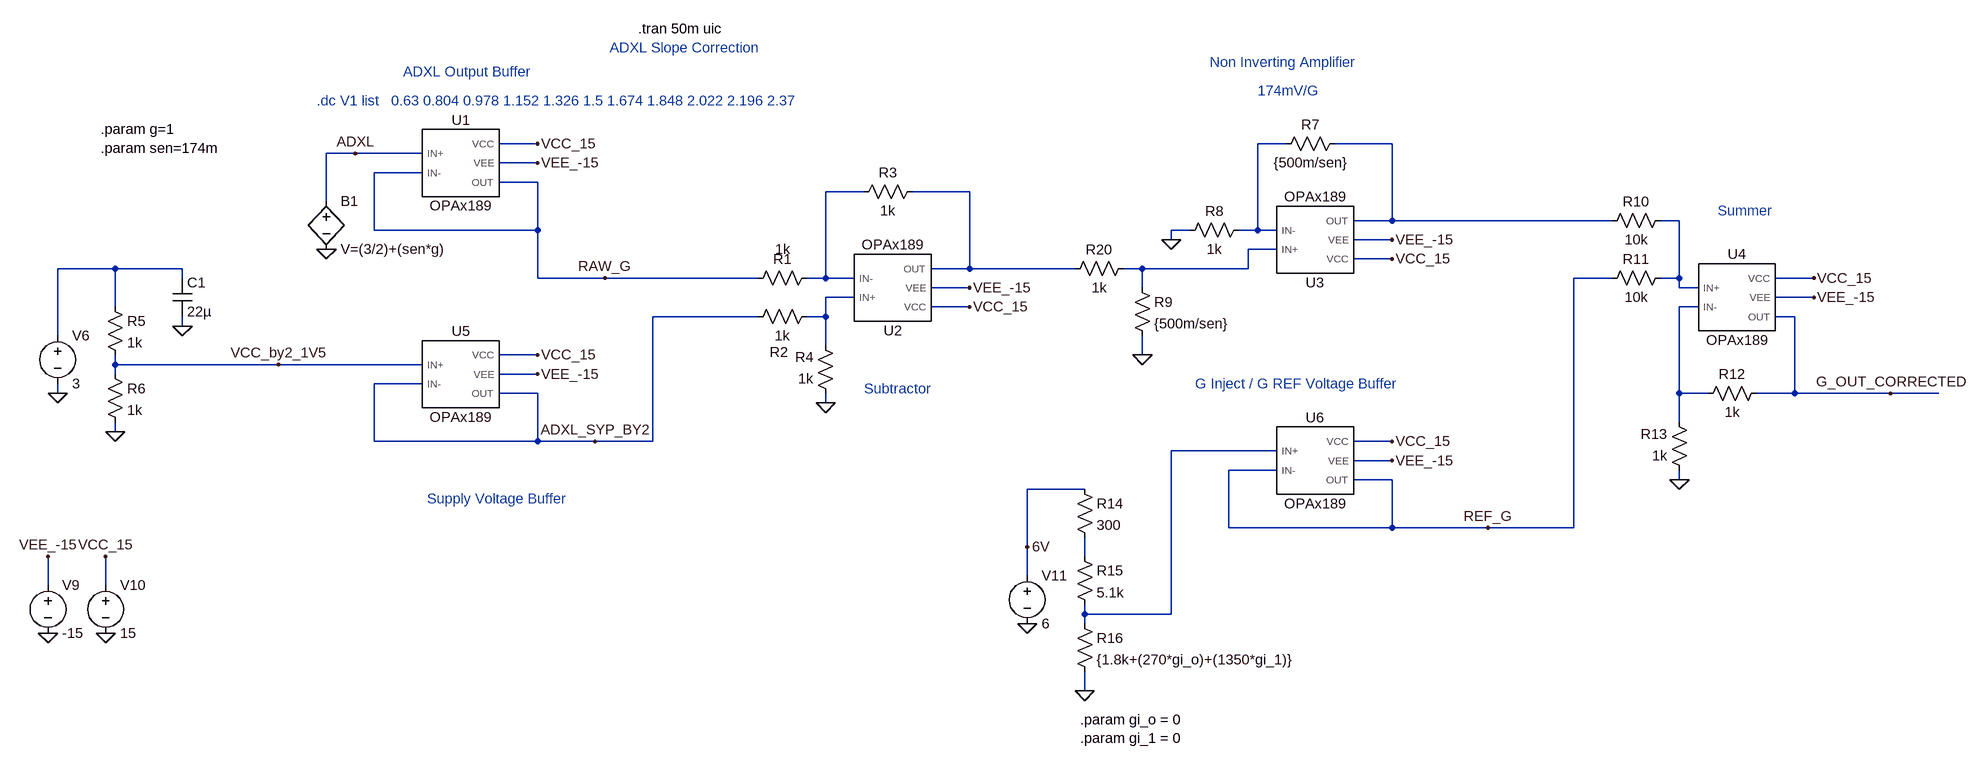
[diagram p0: schematic Sensor slope correction 10062026.asc]
Sensor slope correction 10062026.asc, the LTspice schematic file:
Version 4.1
SHEET 1 7492 1060
WIRE 352 -336 288 -336
WIRE 1600 -336 1552 -336
WIRE 1776 -336 1680 -336
WIRE 48 -320 0 -320
WIRE 160 -320 48 -320
WIRE 352 -304 288 -304
WIRE 160 -288 80 -288
WIRE 352 -272 288 -272
WIRE 896 -256 832 -256
WIRE 1072 -256 976 -256
WIRE 0 -240 0 -320
WIRE 1776 -208 1776 -336
WIRE 1776 -208 1712 -208
WIRE 2208 -208 1776 -208
WIRE 2320 -208 2288 -208
WIRE 80 -192 80 -288
WIRE 352 -192 352 -272
WIRE 352 -192 80 -192
WIRE 1440 -192 1408 -192
WIRE 1552 -192 1552 -336
WIRE 1552 -192 1520 -192
WIRE 1584 -192 1552 -192
WIRE 1408 -176 1408 -192
WIRE 1776 -176 1712 -176
WIRE 1584 -160 1536 -160
WIRE 1776 -144 1712 -144
WIRE -352 -128 -448 -128
WIRE -240 -128 -352 -128
WIRE 1072 -128 1072 -256
WIRE 1072 -128 1008 -128
WIRE 1248 -128 1072 -128
WIRE 1360 -128 1328 -128
WIRE 1536 -128 1536 -160
WIRE 1536 -128 1360 -128
WIRE -240 -112 -240 -128
WIRE 352 -112 352 -192
WIRE 464 -112 352 -112
WIRE 720 -112 464 -112
WIRE 832 -112 832 -256
WIRE 832 -112 800 -112
WIRE 880 -112 832 -112
WIRE 2208 -112 2144 -112
WIRE 2320 -112 2320 -208
WIRE 2320 -112 2288 -112
WIRE 2544 -112 2480 -112
WIRE 1072 -96 1008 -96
WIRE 1360 -96 1360 -128
WIRE 2320 -96 2320 -112
WIRE 2352 -96 2320 -96
WIRE 880 -80 832 -80
WIRE 2544 -80 2480 -80
WIRE -352 -64 -352 -128
WIRE 1072 -64 1008 -64
WIRE 2352 -64 2320 -64
WIRE 720 -48 544 -48
WIRE 832 -48 832 -80
WIRE 832 -48 800 -48
WIRE 2512 -48 2480 -48
WIRE -240 -32 -240 -48
WIRE -448 -16 -448 -128
WIRE 832 0 832 -48
WIRE 352 16 288 16
WIRE 1360 16 1360 -16
WIRE -352 32 -352 16
WIRE -80 32 -352 32
WIRE 160 32 -80 32
WIRE -352 48 -352 32
WIRE 352 48 288 48
WIRE 160 64 80 64
WIRE -448 80 -448 64
WIRE 352 80 288 80
WIRE 2320 80 2320 -64
WIRE 2368 80 2320 80
WIRE 2512 80 2512 -48
WIRE 2512 80 2448 80
WIRE 2672 80 2512 80
WIRE 2752 80 2672 80
WIRE 832 96 832 80
WIRE 2320 128 2320 80
WIRE -352 144 -352 128
WIRE 80 160 80 64
WIRE 352 160 352 80
WIRE 352 160 80 160
WIRE 448 160 352 160
WIRE 544 160 544 -48
WIRE 544 160 448 160
WIRE 1776 160 1712 160
WIRE 1584 176 1408 176
WIRE 1776 192 1712 192
WIRE 1584 208 1504 208
WIRE 1776 224 1712 224
WIRE 2320 224 2320 208
WIRE 1264 240 1168 240
WIRE 1504 304 1504 208
WIRE 1776 304 1776 224
WIRE 1776 304 1504 304
WIRE 1936 304 1776 304
WIRE 2144 304 2144 -112
WIRE 2144 304 1936 304
WIRE 1168 336 1168 240
WIRE 1264 352 1264 320
WIRE 1168 384 1168 336
WIRE -464 400 -464 352
WIRE -368 400 -368 352
WIRE 1264 448 1264 432
WIRE 1408 448 1408 176
WIRE 1408 448 1264 448
WIRE 1264 464 1264 448
WIRE 1264 576 1264 544
FLAG 0 -160 0
FLAG 832 96 0
FLAG -448 80 0
FLAG -352 144 0
FLAG 1360 16 0
FLAG -464 480 0
FLAG -368 480 0
FLAG 2320 224 0
FLAG 1168 464 0
FLAG 1264 576 0
FLAG -240 -32 0
FLAG -464 352 VEE_-15
FLAG -368 352 VCC_15
FLAG 2544 -112 VCC_15
FLAG 2544 -80 VEE_-15
FLAG 1776 160 VCC_15
FLAG 1776 192 VEE_-15
FLAG 352 -336 VCC_15
FLAG 352 -304 VEE_-15
FLAG 352 16 VCC_15
FLAG 352 48 VEE_-15
FLAG 1072 -96 VEE_-15
FLAG 1072 -64 VCC_15
FLAG 1776 -176 VEE_-15
FLAG 1776 -144 VCC_15
FLAG 1936 304 REF_G
FLAG 464 -112 RAW_G
FLAG 448 160 ADXL_SYP_BY2
FLAG 2672 80 G_OUT_CORRECTED
FLAG 1168 336 6V
FLAG 1408 -176 0
FLAG 48 -320 ADXL
FLAG -80 32 VCC_by2_1V5
SYMBOL OPAx189 224 -304 R0
SYMATTR InstName U1
SYMBOL OPAx189 944 -96 M180
SYMATTR InstName U2
SYMBOL res 816 -128 R90
WINDOW 0 0 56 VBottom 2
WINDOW 3 -48 55 VTop 2
SYMATTR InstName R1
SYMATTR Value 1k
SYMATTR SpiceLine tol=0.1 pwr=0.1
SYMBOL res 816 -64 R90
WINDOW 0 91 62 VBottom 2
WINDOW 3 32 56 VTop 2
SYMATTR InstName R2
SYMATTR Value 1k
SYMATTR SpiceLine tol=0.1 pwr=0.1
SYMBOL res 992 -272 R90
WINDOW 0 0 56 VBottom 2
WINDOW 3 32 56 VTop 2
SYMATTR InstName R3
SYMATTR Value 1k
SYMATTR SpiceLine tol=0.1 pwr=0.1
SYMBOL res 848 96 R180
WINDOW 0 36 76 Left 2
WINDOW 3 36 40 Left 2
SYMATTR InstName R4
SYMATTR Value 1k
SYMATTR SpiceLine tol=0.1 pwr=0.1
SYMBOL voltage -448 -32 R0
WINDOW 123 0 0 Left 0
WINDOW 39 0 0 Left 0
SYMATTR InstName V6
SYMATTR Value 3
SYMBOL res -368 -80 R0
SYMATTR InstName R5
SYMATTR Value 1k
SYMATTR SpiceLine tol=0.1 pwr=0.1
SYMBOL res -368 32 R0
SYMATTR InstName R6
SYMATTR Value 1k
SYMATTR SpiceLine tol=0.1 pwr=0.1
SYMBOL OPAx189 1648 -176 M180
SYMATTR InstName U3
SYMBOL res 1696 -352 R90
WINDOW 0 0 56 VBottom 2
WINDOW 3 32 56 VTop 2
SYMATTR InstName R7
SYMATTR Value {500m/sen}
SYMATTR SpiceLine tol=0.1 pwr=0.1
SYMBOL res 1536 -208 R90
WINDOW 0 0 56 VBottom 2
WINDOW 3 32 56 VTop 2
SYMATTR InstName R8
SYMATTR Value 1k
SYMATTR SpiceLine tol=0.1 pwr=0.1
SYMBOL res 1344 -112 R0
SYMATTR InstName R9
SYMATTR Value {500m/sen}
SYMATTR SpiceLine tol=0.1 pwr=0.1
SYMBOL OPAx189 2416 -80 R0
SYMATTR InstName U4
SYMBOL voltage -464 384 R0
WINDOW 123 0 0 Left 0
WINDOW 39 0 0 Left 0
SYMATTR InstName V9
SYMATTR Value -15
SYMBOL voltage -368 384 R0
WINDOW 123 0 0 Left 0
WINDOW 39 0 0 Left 0
SYMATTR InstName V10
SYMATTR Value 15
SYMBOL res 2304 -224 R90
WINDOW 0 0 56 VBottom 2
WINDOW 3 32 56 VTop 2
SYMATTR InstName R10
SYMATTR Value 10k
SYMATTR SpiceLine tol=0.1 pwr=0.1
SYMBOL res 2304 -128 R90
WINDOW 0 0 56 VBottom 2
WINDOW 3 32 56 VTop 2
SYMATTR InstName R11
SYMATTR Value 10k
SYMATTR SpiceLine tol=0.1 pwr=0.1
SYMBOL res 2464 64 R90
WINDOW 0 0 56 VBottom 2
WINDOW 3 32 56 VTop 2
SYMATTR InstName R12
SYMATTR Value 1k
SYMATTR SpiceLine tol=0.1 pwr=0.1
SYMBOL res 2336 224 R180
WINDOW 0 36 76 Left 2
WINDOW 3 36 40 Left 2
SYMATTR InstName R13
SYMATTR Value 1k
SYMATTR SpiceLine tol=0.1 pwr=0.1
SYMBOL voltage 1168 368 R0
WINDOW 123 0 0 Left 0
WINDOW 39 0 0 Left 0
SYMATTR InstName V11
SYMATTR Value 6
SYMBOL res 1248 224 R0
SYMATTR InstName R14
SYMATTR Value 300
SYMATTR SpiceLine tol=0.1 pwr=0.1
SYMBOL res 1248 336 R0
SYMATTR InstName R15
SYMATTR Value 5.1k
SYMATTR SpiceLine tol=0.1 pwr=0.1
SYMBOL res 1248 448 R0
SYMATTR InstName R16
SYMATTR Value {1.8k+(270*gi_o)+(1350*gi_1)}
SYMBOL cap -256 -112 R0
SYMATTR Value 22µ
SYMATTR InstName C1
SYMATTR SpiceLine V=50 Irms=75m Rser=1.9 Lser=0 mfg="Nichicon" pn="UPR1H220MAH" type="Al electrolytic"
SYMBOL OPAx189 224 48 R0
SYMATTR InstName U5
SYMBOL OPAx189 1648 192 R0
SYMATTR InstName U6
SYMBOL res 1344 -144 R90
WINDOW 0 0 56 VBottom 2
WINDOW 3 32 56 VTop 2
SYMATTR InstName R20
SYMATTR Value 1k
SYMBOL bv 0 -256 R0
SYMATTR InstName B1
SYMATTR Value V=(3/2)+(sen*g)
TEXT 520 -528 Left 2 !.tran 50m uic
TEXT 1552 -424 Left 2 ;174mV/G
TEXT 472 -496 Left 2 ;ADXL Slope Correction
TEXT 168 256 Left 2 ;Supply Voltage Buffer
TEXT 128 -456 Left 2 ;ADXL Output Buffer
TEXT 896 72 Left 2 ;Subtractor
TEXT 1472 -472 Left 2 ;Non Inverting Amplifier
TEXT 1448 64 Left 2 ;G Inject / G REF Voltage Buffer
TEXT 2384 -224 Left 2 ;Summer
TEXT -16 -408 Left 2 ;.dc V1 list   0.63 0.804 0.978 1.152 1.326 1.5 1.674 1.848 2.022 2.196 2.37
TEXT -376 -360 Left 2 !.param g=1\n.param sen=174m
TEXT 1256 624 Left 2 !.param gi_o = 0\n.param gi_1 = 0

The netlist it stands for:
* Sensor slope correction 10062026.asc
X§U1 ADXL RAW_G VCC_15 VEE_-15 RAW_G OPAx189  ; pins IN+ IN- VCC VEE OUT
X§U2 N008 N003 VCC_15 VEE_-15 N004 OPAx189  ; pins IN+ IN- VCC VEE OUT
R1 N003 RAW_G 1k tol=0.1 pwr=0.1
R2 N008 ADXL_SYP_BY2 1k tol=0.1 pwr=0.1
R3 N004 N003 1k tol=0.1 pwr=0.1
R4 0 N008 1k tol=0.1 pwr=0.1
V6 N007 0 3
R5 N007 VCC_by2_1V5 1k tol=0.1 pwr=0.1
R6 VCC_by2_1V5 0 1k tol=0.1 pwr=0.1
X§U3 N006 N001 VCC_15 VEE_-15 N002 OPAx189  ; pins IN+ IN- VCC VEE OUT
R7 N002 N001 {500m/sen} tol=0.1 pwr=0.1
R8 N001 0 1k tol=0.1 pwr=0.1
R9 N006 0 {500m/sen} tol=0.1 pwr=0.1
X§U4 N005 N009 VCC_15 VEE_-15 G_OUT_CORRECTED OPAx189  ; pins IN+ IN- VCC VEE OUT
V9 VEE_-15 0 -15
V10 VCC_15 0 15
R10 N005 N002 10k tol=0.1 pwr=0.1
R11 N005 REF_G 10k tol=0.1 pwr=0.1
R12 G_OUT_CORRECTED N009 1k tol=0.1 pwr=0.1
R13 0 N009 1k tol=0.1 pwr=0.1
V11 6V 0 6
R14 6V N011 300 tol=0.1 pwr=0.1
R15 N011 N010 5.1k tol=0.1 pwr=0.1
R16 N010 0 {1.8k+(270*gi_o)+(1350*gi_1)}
C1 N007 0 22µ V=50 Irms=75m Rser=1.9 Lser=0 mfg="Nichicon" pn="UPR1H220MAH" type="Al electrolytic"
X§U5 VCC_by2_1V5 ADXL_SYP_BY2 VCC_15 VEE_-15 ADXL_SYP_BY2 OPAx189  ; pins IN+ IN- VCC VEE OUT
X§U6 N010 REF_G VCC_15 VEE_-15 REF_G OPAx189  ; pins IN+ IN- VCC VEE OUT
R20 N006 N004 1k
B1 ADXL 0 V=(3/2)+(sen*g)
.tran 50m uic
* 174mV/G
* ADXL Slope Correction
* Supply Voltage Buffer
* ADXL Output Buffer
* Subtractor
* Non Inverting Amplifier
* G Inject / G REF Voltage Buffer
* Summer
* .dc V1 list   0.63 0.804 0.978 1.152 1.326 1.5 1.674 1.848 2.022 2.196 2.37
.param g=1
.param sen=174m
.param gi_o = 0
.param gi_1 = 0
.lib C:\Users\MINI\AppData\Local\LTspice\lib\sym\OPAx189.LIB
.backanno
.end